# EAGLE board EMG_SS19_Version (EAGLE 9.4.1)
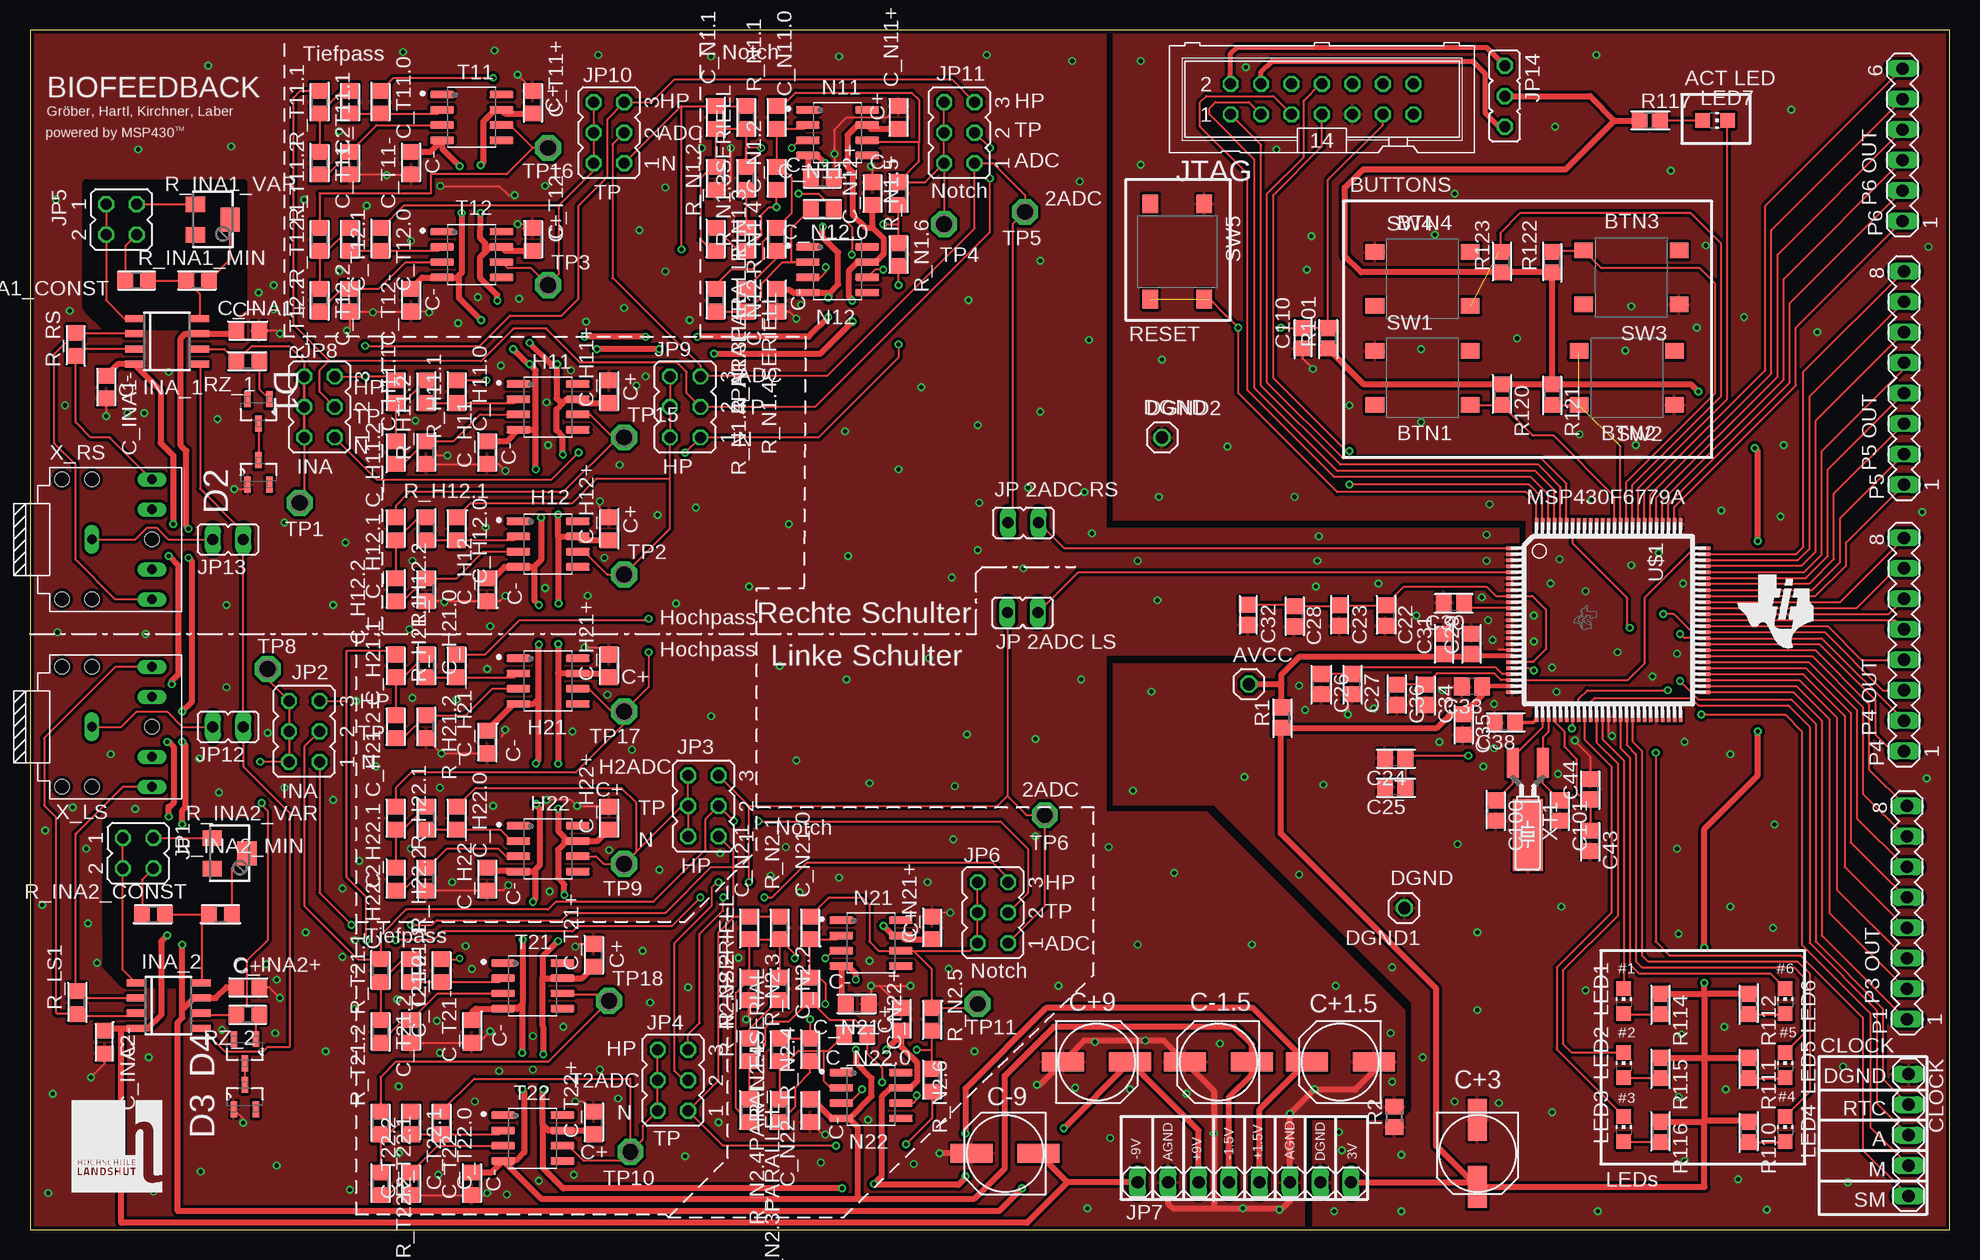
[diagram p2: board, top side]
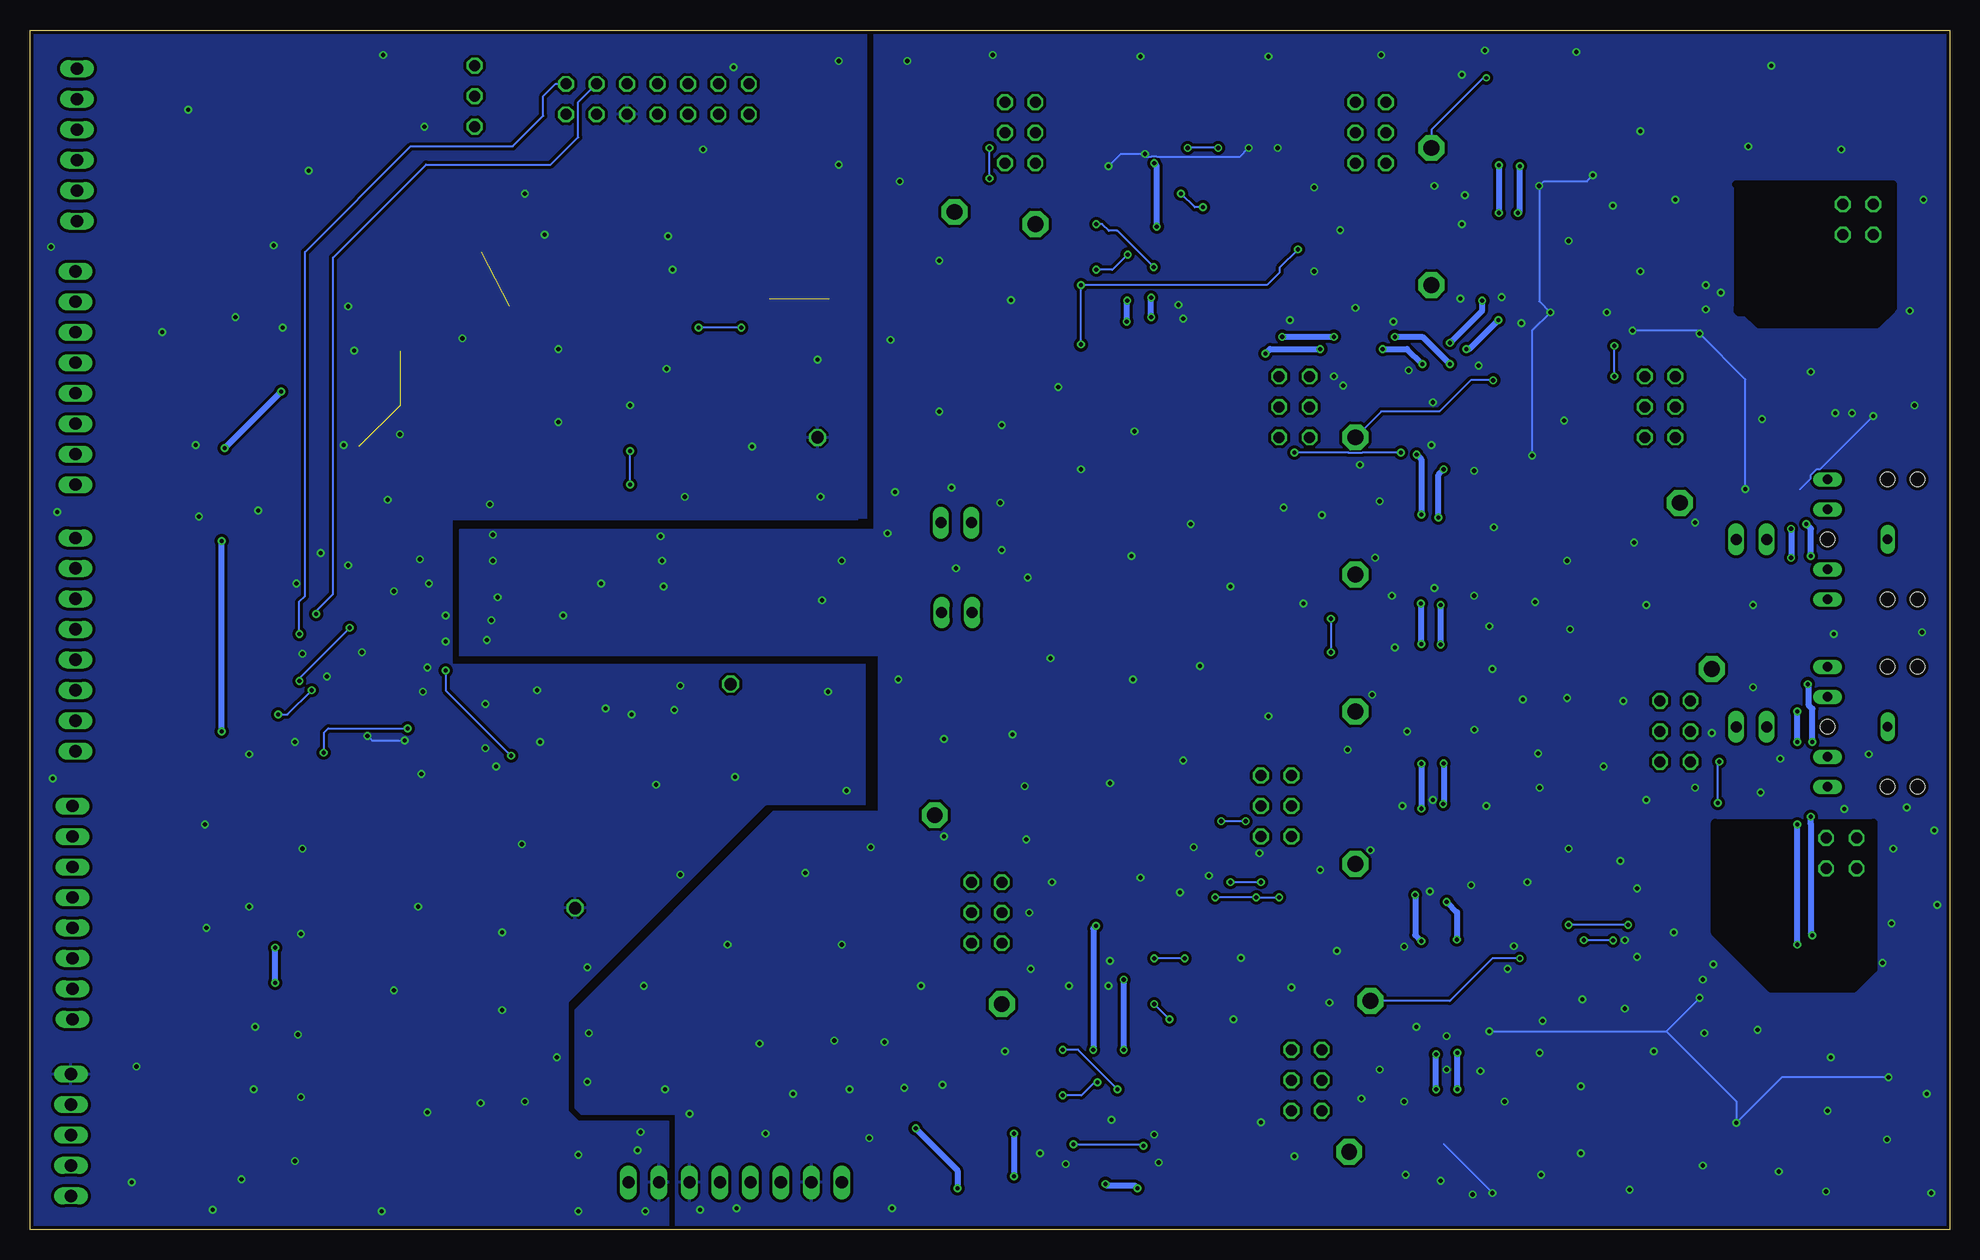
[diagram p3: board, bottom side, seen from below]

Size 160 x 100 mm. Coordinates in mm from the lower left corner, seen from the top.
Outline: 0,0 160,0 160,100 0,100 0,0
Copper layers (1*16): Top 0.035mm / dielectric 1.5mm / Bottom 0.035mm
Design rules "PCB-POOL Standard": minimum track width 0.15mm, minimum drill 0.3mm, track to track 0.15mm, track to pad 0.15mm, pad to pad 0.15mm, via to via 0.15mm, smd to smd 0.15mm, copper to edge 0.3mm, drill to drill 0.2mm, minimum pad ring 0.2mm, minimum via ring 0.15mm, stop-mask expansion 0.03mm, vias tented up to drill 0mil, thermal gap 0.2mm
tRestrict: area 4.7,76.8 to 17.8,87.2; area 6.3,24.9 to 19.7,34; area 4.8,75.3 to 17.7,76.8; area 6.3,20.4 to 19.7,24.9
bRestrict: area 4.7,76.8 to 17.8,87.1; area 6.3,24.9 to 19.6,33.9; area 6.3,20.1 to 19.6,24.9; area 4.8,75.4 to 17.7,76.8

## Footprints (pad centres in the part's own frame; a part is rotated, then mirrored left to right if it is on the bottom)
1X01 = drill 1.016 octagon: 1 0,0
C0805 = smd 1.3 x 1.5: 1 -0.85,0; 2 0.85,0
RADIAL_SMD_ELKO_6_3 = smd 3.5 x 1.6: + 2.8,0; - -2.8,0
C0805' = smd 1.3 x 1.5: 1 -0.95,0; 2 0.95,0
MA05-1 = drill 1.016 long: 1 -5.08,0; 2 -2.54,0; 3 0,0; 4 2.54,0; 5 5.08,0
SOT-23 = smd 1.321 x 0.559: 1 -1.016,0.914; 2 -1.016,-0.914; 3 1.016,0
SOIC127P600X175-8N = smd 1.97 x 0.6: 1 -2.475,1.905; 2 -2.475,0.635; 3 -2.475,-0.635; 4 -2.475,-1.905; 5 2.475,-1.905; 6 2.475,-0.635; 7 2.475,0.635; 8 2.475,1.905
SOIC8 = smd 0.6 x 1.5: 1 -1.905,-2.75; 2 -0.635,-2.75; 3 0.635,-2.75; 4 1.905,-2.75; 5 1.905,2.75; 6 0.635,2.75; 7 -0.635,2.75; 8 -1.905,2.75
JP2Q = drill 0.914 octagon: 1 -1.27,-1.27; 2 -1.27,1.27; 3 1.27,-1.27; 4 1.27,1.27
JP3Q = drill 0.914 octagon: 1 -2.54,-1.27; 2 -2.54,1.27; 3 0,-1.27; 4 0,1.27; 5 2.54,-1.27; 6 2.54,1.27
1X08 = drill 1.016 long: 1 -8.89,0; 2 -6.35,0; 3 -3.81,0; 4 -1.27,0; 5 1.27,0; 6 3.81,0; 7 6.35,0; 8 8.89,0
JP1 = drill 0.914 long: 1 0,-1.27; 2 0,1.27
JP2 = drill 0.914 octagon: 1 -2.54,0; 2 0,0; 3 2.54,0
ML14 = drill 0.914 octagon: 1 -7.62,-1.27; 2 -7.62,1.27; 3 -5.08,-1.27; 4 -5.08,1.27; 5 -2.54,-1.27; 6 -2.54,1.27; 7 0,-1.27; 8 0,1.27; 9 2.54,-1.27; 10 2.54,1.27; 11 5.08,-1.27; 12 5.08,1.27; 13 7.62,-1.27; 14 7.62,1.27
CHIP-LED0805 = smd 1.2 x 1.2: A 0,-1.05; C 0,1.05
MA08-1 = drill 1.016 long: 1 -8.89,0; 2 -6.35,0; 3 -3.81,0; 4 -1.27,0; 5 1.27,0; 6 3.81,0; 7 6.35,0; 8 8.89,0
MA06-1 = drill 1.016 long: 1 -6.35,0; 2 -3.81,0; 3 -1.27,0; 4 1.27,0; 5 3.81,0; 6 6.35,0
R0805 = smd 1.3 x 1.5: 1 -0.85,0; 2 0.85,0
R0805' = smd 1.3 x 1.5: 1 -0.95,0; 2 0.95,0
SM-42/43W = smd 1.3 x 1.6: 1 -1.27,-1.45; 3 1.27,-1.45 | smd 2 x 1.6: 2 0,1.45
SW_B3S-1000 = smd 1.55 x 1.3: 1 3.975,-2.25; 2 -3.975,-2.25; 3 3.975,2.25; 4 -3.975,2.25
P1-13 = drill 1.321 pad 2.159 octagon: TP 0,0
S-PQFP-G100(PZ) = smd 0.29 x 1: 1 -6,-8; 2 -5.5,-8; 3 -5,-8; 4 -4.5,-8; 5 -4,-8; 6 -3.5,-8; 7 -3,-8; 8 -2.5,-8; 9 -2,-8; 10 -1.5,-8; 11 -1,-8; 12 -0.5,-8; 13 0,-8; 14 0.5,-8; 15 1,-8; 16 1.5,-8; 17 2,-8; 18 2.5,-8; 19 3,-8; 20 3.5,-8; 21 4,-8; 22 4.5,-8; 23 5,-8; 24 5.5,-8; 25 6,-8; 51 6,8; 52 5.5,8; 53 5,8; 54 4.5,8; 55 4,8; 56 3.5,8; 57 3,8; 58 2.5,8; 59 2,8; 60 1.5,8; 61 1,8; 62 0.5,8; 63 0,8; 64 -0.5,8; 65 -1,8; 66 -1.5,8; 67 -2,8; 68 -2.5,8; 69 -3,8; 70 -3.5,8; 71 -4,8; 72 -4.5,8; 73 -5,8; 74 -5.5,8; 75 -6,8 | smd 1 x 0.29: 26 8,-6; 27 8,-5.5; 28 8,-5; 29 8,-4.5; 30 8,-4; 31 8,-3.5; 32 8,-3; 33 8,-2.5; 34 8,-2; 35 8,-1.5; 36 8,-1; 37 8,-0.5; 38 8,0; 39 8,0.5; 40 8,1; 41 8,1.5; 42 8,2; 43 8,2.5; 44 8,3; 45 8,3.5; 46 8,4; 47 8,4.5; 48 8,5; 49 8,5.5; 50 8,6; 76 -8,6; 77 -8,5.5; 78 -8,5; 79 -8,4.5; 80 -8,4; 81 -8,3.5; 82 -8,3; 83 -8,2.5; 84 -8,2; 85 -8,1.5; 86 -8,1; 87 -8,0.5; 88 -8,0; 89 -8,-0.5; 90 -8,-1; 91 -8,-1.5; 92 -8,-2; 93 -8,-2.5; 94 -8,-3; 95 -8,-3.5; 96 -8,-4; 97 -8,-4.5; 98 -8,-5; 99 -8,-5.5; 100 -8,-6
FC68131-5P = drill 0.8 long: 1 -5,0; 2 0,-5; 3 0,-2.5; 4 0,2.5; 5 0,5 | hole 1.2: 0,0; -5,-5; -5,5; -7.5,5; -7.5,-5
CM200T = smd 1 x 2.5: P1 -1.25,-5; P2 1.25,-5 | smd 2.5 x 6: P3 0,1

## Placement (x,y rotation side)
AVCC  [1X01]  101.6,45.47 0 top
C22  4.7uF  [C0805]  112.97,51.18 270 top
C23  100nF  [C0805]  109.16,51.18 270 top
C24  4.7uF  [C0805]  113.79,39.31 180 top
C25  100nF  [C0805]  113.79,36.89 180 top
C26  4.7uF  [C0805]  107.63,45.47 270 top
C27  100nF  [C0805]  110.17,45.47 270 top
C28  100nF  [C0805]  105.35,51.12 270 top
C29  4.7uF  [C0805]  120.14,48.83 90 top
C30  100nF  [C0805]  118.68,52.26 180 top
C31  100nF  [C0805]  117.86,48.83 90 top
C32  4.7uF  [C0805]  101.54,51.24 270 top
C33  100nF  [C0805]  120.21,45.28 180 top
C34  4.7uF  [C0805]  116.33,44.58 270 top
C35  4.7uF  [C0805]  119.44,42.1 270 top
C36  100nF  [C0805]  113.92,44.58 270 top
C38  0.47uF  [C0805]  122.94,42.29 180 top
C43  100nF  [C0805]  130.05,32.38 270 top
C44  0.47uF  [C0805]  130.05,36.7 90 top
C100  12pF  [C0805]  122.17,34.92 270 top
C101  12pF  [C0805]  127.51,34.92 270 top
C110  0.1uF  [C0805]  106.05,74.3 90 top
C+1.5  100u  [RADIAL_SMD_ELKO_6_3]  109.22,13.97 180 top
C+3  100u  [RADIAL_SMD_ELKO_6_3]  120.65,6.35 270 top
C+9  100u  [RADIAL_SMD_ELKO_6_3]  88.9,13.97 0 top
C-1.5  100u  [RADIAL_SMD_ELKO_6_3]  99.06,13.97 180 top
C-9  100u  [RADIAL_SMD_ELKO_6_3]  81.28,6.35 180 top
C_H11+  100n  [C0805']  48.26,69.85 90 top
C_H11-  100n  [C0805']  38.1,64.77 90 top
C_H11.0  10p  [C0805']  35.56,69.85 270 top
C_H11.1  470n  [C0805']  30.48,69.85 270 top
C_H11.2  470n  [C0805']  30.48,64.77 270 top
C_H12+  100n  [C0805']  48.26,58.42 90 top
C_H12-  100n  [C0805']  38.1,53.34 90 top
C_H12.0  10p  [C0805']  35.56,58.42 270 top
C_H12.1  470n  [C0805']  30.48,58.42 270 top
C_H12.2  470n  [C0805']  30.48,53.34 270 top
C_H21+  100n  [C0805']  48.26,46.99 90 top
C_H21-  100n  [C0805']  38.1,40.64 90 top
C_H21.0  10p  [C0805']  35.56,46.99 270 top
C_H21.1  470n  [C0805']  30.48,46.99 270 top
C_H21.2  470n  [C0805']  30.48,41.91 270 top
C_H22+  100n  [C0805']  48.26,34.29 90 top
C_H22-  100n  [C0805']  38.1,29.21 90 top
C_H22.0  10p  [C0805']  35.56,34.29 270 top
C_H22.1  470n  [C0805']  30.48,34.29 270 top
C_H22.2  470n  [C0805']  30.48,29.21 270 top
C_INA1+  100n  [C0805']  18.16,74.93 0 top
C_INA1-  100n  [C0805']  6.35,70.23 270 top
C_INA2+  100n  [C0805']  18.16,20.19 0 top
C_INA2-  100n  [C0805']  6.22,15.62 270 top
C_N1.1  470n  [C0805']  57.15,92.71 270 top
C_N1.2  4.7n  [C0805']  62.23,87.63 90 top
C_N2.1  470n  [C0805']  59.94,25.15 270 top
C_N2.2  4.7n  [C0805']  65.02,20.07 90 top
C_N11+  100n  [C0805']  72.39,92.71 90 top
C_N11-  100n  [C0805']  66.04,87.63 180 top
C_N11.0  10p  [C0805']  62.23,92.71 270 top
C_N12+  100n  [C0805']  70.23,86.36 90 top
C_N12-  100n  [C0805']  62.23,77.47 90 top
C_N12.0  10p  [C0805']  66.04,85.09 0 top
C_N21+  100n  [C0805']  75.18,25.15 90 top
C_N21-  100n  [C0805']  68.96,18.8 180 top
C_N21.0  10p  [C0805']  65.02,25.15 270 top
C_N22+  100n  [C0805']  72.64,17.53 90 top
C_N22-  100n  [C0805']  65.02,9.91 90 top
C_N22.0  10p  [C0805']  68.83,16.26 0 top
C_T11+  100n  [C0805']  41.91,93.98 90 top
C_T11-  100n  [C0805']  31.75,88.9 90 top
C_T11.0  10p  [C0805']  29.21,93.98 270 top
C_T11.1  10n  [C0805']  26.67,93.98 270 top
C_T11.2  4.7n  [C0805']  26.67,88.9 90 top
C_T12+  100n  [C0805']  41.91,82.55 90 top
C_T12-  100n  [C0805']  31.75,77.47 90 top
C_T12.0  10p  [C0805']  29.21,82.55 270 top
C_T12.1  10n  [C0805']  26.67,82.55 270 top
C_T12.2  4.7n  [C0805']  26.67,77.47 90 top
C_T21+  100n  [C0805']  46.99,22.86 90 top
C_T21-  100n  [C0805']  36.83,16.51 90 top
C_T21.0  10p  [C0805']  34.29,21.59 270 top
C_T21.1  10n  [C0805']  31.75,21.59 270 top
C_T21.2  4.7n  [C0805']  31.75,16.51 90 top
C_T22+  100n  [C0805']  46.99,8.89 90 top
C_T22-  100n  [C0805']  36.83,3.81 90 top
C_T22.0  10p  [C0805']  34.29,8.89 270 top
C_T22.1  10n  [C0805']  31.75,8.89 270 top
C_T22.2  4.7n  [C0805']  31.75,3.81 90 top
CLOCK  [MA05-1]  156.59,7.87 270 top
D1  Zener  [SOT-23]  19.05,68.2 270 top
D2  Zener  [SOT-23]  19.05,63.12 90 top
D3  Zener  [SOT-23]  17.91,11.05 90 top
D4  Zener  [SOT-23]  17.91,14.86 270 top
DGND1  [1X01]  114.55,26.8 180 top
DGND2  [1X01]  94.36,66.04 0 top
H11  OPA388  [SOIC127P600X175-8N]  43.18,68.58 0 top
H12  OPA388  [SOIC127P600X175-8N]  43.18,57.15 0 top
H21  OPA388  [SOIC127P600X175-8N]  43.18,45.72 0 top
H22  OPA388  [SOIC127P600X175-8N]  43.18,31.75 0 top
INA_1  INA828ID  [SOIC8]  11.43,74.04 270 top
INA_2  INA828ID  [SOIC8]  11.56,18.67 270 top
JP1  [JP2Q]  9.02,31.37 270 top
JP2  [JP3Q]  22.86,41.53 90 top
JP3  [JP3Q]  56.13,35.31 90 top
JP4  [JP3Q]  53.59,12.45 90 top
JP5  [JP2Q]  7.62,84.2 270 top
JP6  [JP3Q]  80.26,26.42 90 top
JP7  [1X08]  101.22,3.94 0 top
JP8  [JP3Q]  24.13,68.58 90 top
JP9  [JP3Q]  54.61,68.58 90 top
JP10  [JP3Q]  48.26,91.44 90 top
JP11  [JP3Q]  77.47,91.44 90 top
JP12  [JP1]  16.51,41.91 90 top
JP13  [JP1]  16.51,57.53 90 top
JP14  [JP2]  122.94,94.49 270 top
JP15  [JP1]  82.8,58.93 90 top
JP16  [JP1]  82.74,51.44 90 top
JTAG  [ML14]  107.7,94.23 0 top
LED1  [CHIP-LED0805]  132.84,19.05 0 top
LED2  [CHIP-LED0805]  132.84,13.72 0 top
LED3  [CHIP-LED0805]  132.84,8.38 0 top
LED4  [CHIP-LED0805]  146.3,8.38 0 top
LED5  [CHIP-LED0805]  146.3,13.72 0 top
LED6  [CHIP-LED0805]  146.3,19.05 0 top
LED7  [CHIP-LED0805]  140.46,92.46 270 top
N11  OPA388  [SOIC127P600X175-8N]  67.31,91.44 0 top
N12  OPA388  [SOIC127P600X175-8N]  67.31,80.01 0 top
N21  OPA388  [SOIC127P600X175-8N]  70.1,23.88 0 top
N22  OPA388  [SOIC127P600X175-8N]  70.1,11.18 0 top
P1  [MA08-1]  156.46,26.42 90 top
P4  [MA08-1]  156.21,48.77 90 top
P5  [MA08-1]  156.21,70.99 90 top
P6  [MA06-1]  156.08,90.42 90 top
R1  10R  [R0805]  104.33,42.67 90 top
R2  0R  [R0805]  113.73,9.4 90 top
R101  47K  [R0805]  108.2,74.3 90 top
R110  100  [R0805]  143.26,8.13 270 top
R111  100  [R0805]  143.26,13.46 270 top
R112  100  [R0805]  143.26,18.8 270 top
R114  100  [R0805]  135.89,18.8 270 top
R115  100  [R0805]  135.89,13.46 270 top
R116  100  [R0805]  135.89,8.13 270 top
R117  100  [R0805]  135,92.46 0 top
R120  100K  [R0805]  122.68,69.6 270 top
R121  100K  [R0805]  126.87,69.6 270 top
R122  100K  [R0805]  126.87,80.64 90 top
R123  100K  [R0805]  122.68,80.64 90 top
R_H11.1  48k  [R0805']  33.02,69.85 270 top
R_H11.2  100k  [R0805']  33.02,64.77 90 top
R_H12.1  48k  [R0805']  33.02,58.42 270 top
R_H12.2  100k  [R0805']  33.02,53.34 90 top
R_H21.1  48k  [R0805']  33.02,46.99 270 top
R_H21.2  100k  [R0805']  33.02,41.91 90 top
R_H22.1  48k  [R0805']  33.02,34.29 270 top
R_H22.2  100k  [R0805']  33.02,29.21 90 top
R_INA1_CONST  200  [R0805']  8.89,79.12 0 top
R_INA1_MIN  50  [R0805']  13.97,79.12 180 top
R_INA1_VAR  200  [SM-42/43W]  15.24,84.2 270 top
R_INA2_CONST  200  [R0805']  10.29,26.29 0 top
R_INA2_MIN  50  [R0805']  15.88,26.29 180 top
R_INA2_VAR  200  [SM-42/43W]  16.64,31.37 270 top
R_LS1  10Meg  [R0805']  3.94,18.92 90 top
R_N1.1  138k  [R0805']  59.69,92.71 270 top
R_N1.2  138k  [R0805']  57.15,87.63 90 top
R_N1.3  6.8k  [R0805']  59.69,87.63 90 top
R_N1.3PARALLEL  dnp  [R0805']  57.15,82.55 270 top
R_N1.3SERIELL  0  [R0805']  59.69,82.55 90 top
R_N1.4  6.8k  [R0805']  62.23,82.55 270 top
R_N1.4PARALLEL  dnp  [R0805']  57.15,77.47 270 top
R_N1.4SERIELL  0  [R0805']  59.69,77.47 270 top
R_N1.5  100k  [R0805']  72.39,86.36 90 top
R_N1.6  100k  [R0805']  72.39,81.28 90 top
R_N2.1  138k  [R0805']  62.48,25.15 270 top
R_N2.2  138k  [R0805']  59.94,20.07 90 top
R_N2.3  6.8k  [R0805']  62.48,20.07 90 top
R_N2.3PARALLEL  dnp  [R0805']  59.94,9.91 270 top
R_N2.3SERIELL  0  [R0805']  59.94,14.99 90 top
R_N2.4  6.8k  [R0805']  65.02,14.99 270 top
R_N2.4PARALLEL  dnp  [R0805']  62.48,14.99 270 top
R_N2.4SERIAL  0  [R0805']  62.48,9.91 90 top
R_N2.5  100k  [R0805']  75.18,17.53 90 top
R_N2.6  100k  [R0805']  75.18,12.45 90 top
R_RS  10Meg  [R0805']  3.81,73.79 90 top
R_T11.1  47k  [R0805']  24.13,93.98 270 top
R_T11.2  47k  [R0805']  24.13,88.9 270 top
R_T12.1  47k  [R0805']  24.13,82.55 270 top
R_T12.2  47k  [R0805']  24.13,77.47 270 top
R_T21.1  47k  [R0805']  29.21,21.59 270 top
R_T21.2  47k  [R0805']  29.21,16.51 270 top
R_T22.1  47k  [R0805']  29.21,8.89 270 top
R_T22.2  47k  [R0805']  29.21,3.81 270 top
RZ_1  2k  [R0805']  18.16,72.39 180 top
RZ_2  2k  [R0805']  18.16,17.91 180 top
SW1  B3S-1000  [SW_B3S-1000]  116.08,70.99 0 top
SW2  B3S-1000  [SW_B3S-1000]  133.1,70.99 180 top
SW3  B3S-1000  [SW_B3S-1000]  133.48,79.38 180 top
SW4  B3S-1000  [SW_B3S-1000]  116.08,79.25 0 top
SW5  B3S-1000  [SW_B3S-1000]  95.63,81.53 270 top
T11  OPA388  [SOIC127P600X175-8N]  36.83,92.71 0 top
T12  OPA388  [SOIC127P600X175-8N]  36.83,81.28 0 top
T21  OPA388  [SOIC127P600X175-8N]  41.91,20.32 0 top
T22  OPA388  [SOIC127P600X175-8N]  41.91,7.62 0 top
TP1  TPPAD1-13  [P1-13]  22.48,60.58 0 top
TP2  TPPAD1-13  [P1-13]  49.53,54.61 0 top
TP3  TPPAD1-13  [P1-13]  43.18,78.74 0 top
TP4  TPPAD1-13  [P1-13]  76.2,83.82 0 top
TP5  RS_TO_ADC  [P1-13]  82.93,84.84 0 top
TP6  LS_TO_ADC  [P1-13]  84.58,34.54 0 top
TP8  TPPAD1-13  [P1-13]  19.81,46.74 0 top
TP9  TPPAD1-13  [P1-13]  49.53,30.48 0 top
TP10  TPPAD1-13  [P1-13]  50.04,6.48 0 top
TP11  TPPAD1-13  [P1-13]  78.99,18.8 0 top
TP15  TPPAD1-13  [P1-13]  49.53,66.04 0 top
TP16  TPPAD1-13  [P1-13]  43.18,90.17 0 top
TP17  TPPAD1-13  [P1-13]  49.53,43.18 0 top
TP18  TPPAD1-13  [P1-13]  48.26,19.05 0 top
U$1  MSP430F6779PZ  [S-PQFP-G100(PZ)]  131.57,50.8 270 top
X_LS  KLINKENBUCHSE  [FC68131-5P]  10.16,41.91 0 top
X_RS  KLINKENBUCHSE  [FC68131-5P]  10.16,57.53 0 top
XT1  [CM200T]  124.84,33.91 180 top

## Tracks (layer width: path | path; a pad name or v marks a point on that pad's centre or on a via)
+1.5V  (via drill 0.35)
  Top 0.508: JP7.5 102.49,10.04 C+1.5.+ 101.93,18.46 84.7,18.46 77.98,11.74 v77.98,8 | 72.64,16.26 72.64,15.21 73.97,13.88 73.97,12.4 73.38,11.81 N22.7 71.75,11.81 70.99,11.05 70.99,4.43 v70.36,3.8 70.43,3.73 77.39,3.73 77.98,4.32 v77.98,4.45 | 72.64,16.26 C_N22+.1 | C_N21+.1 72.89,24.2 N21.7 71.94,24.51 v71.14,25.31 | v71.37,14.99 72.64,16.26 | C_N11+.1 70.1,91.76 N11.7 69.28,92.08 69.22,92.02 68.93,92.02 68.14,91.23 68.14,88.58 68.58,88.14 68.58,84.58 69.63,83.53 70.23,83.53 | C_T11+.1 39.62,93.03 T11.7 38.8,93.34 38.74,93.29 38.7,93.29 37.79,92.37 37.79,88.97 v37.56,88.74 | C_T12+.1 39.62,81.6 T12.7 38.81,81.92 38.74,81.98 38.45,81.98 37.94,81.48 | C_H11+.1 45.97,68.9 H11.7 44.73,69.22 44.36,68.84 | C_H22+.1 47.3,32.38 H22.7 44.55,32.38 | C_T21+.1 46.03,20.95 T21.7 44.32,20.89 42.9,20.89 42.74,21.04 | C_T22+.1 46.67,8.26 T22.7 43.21,8.26 42.74,8.72 | v44.03,48.8 44.01,48.78 44.01,46.35 | 44.01,46.35 44.01,38.85 v44.03,38.83 | v44.03,35.09 44.03,33.21 44.55,32.7 44.55,32.38 | 44.55,32.38 44.55,32.2 44.01,31.66 44.01,29.3 44.54,28.77 v44.54,27.9 | v44.03,24.04 44.03,24.07 42.74,22.77 42.74,21.04 | 42.74,21.04 42.74,16.95 42.8,16.89 v42.8,14.61 | 44.01,57.78 44.01,59.6 v44.03,59.6 | 44.36,68.84 43.88,68.37 43.88,66.63 44.41,66.1 v44.41,64.61 | 44.36,68.84 43.88,69.31 43.88,70.91 43.94,70.97 v43.94,72.14 43.43,72.14 v41.66,73.91 | v68.54,77.43 68.54,77.53 68.27,77.81 68.27,79.92 68.93,80.59 69.73,80.59 N12.7 69.85,80.58 70.39,80.58 71.17,81.36 71.17,82.59 70.23,83.53 | v38.95,77.43 38.95,77.92 37.53,79.33 37.53,81.07 37.94,81.48 | 37.94,81.48 37.94,82.23 37.53,82.64 37.53,83.35 37.54,83.36 37.54,83.59 37.56,83.6 v37.56,84.75
  Top 0.508: v67.69,3.43 44.45,3.43 42.74,5.14 42.74,8.72 | C_H21+.1 47.95,46.35 H21.7 44.01,46.35 | 44.01,57.78 H12.7 45.97,57.47 C_H12+.1 | v42.8,11.68 42.74,11.63 42.74,8.72 | v44.07,52.2 44.01,52.25 44.01,57.78 | 70.23,83.53 C_N12+.1 | v52.45,73.41 v47.24,73.41 | v57.02,73.03 65.91,73.03 v68.58,75.69
  Bottom 0.508: v71.14,25.31 71.37,25.07 v71.37,14.99 | v44.03,38.83 v44.03,35.09 | v44.54,27.9 44.54,24.55 v44.03,24.04 | v44.03,59.6 44.03,64.23 v44.41,64.61 | v38.95,77.43 38.95,76.62 v41.66,73.91 | v37.56,88.74 v37.56,84.75 | v77.98,8 v77.98,4.45 | v70.36,3.8 70.23,3.67 67.94,3.67 v67.69,3.43 | v42.8,11.68 v42.8,14.61 | v44.07,52.2 44.07,48.84 v44.03,48.8 | v43.94,72.14 45.21,73.41 v47.24,73.41 | v57.02,73.03 56.64,73.41 v52.45,73.41 | v68.58,75.69 68.54,75.73 v68.54,77.43
+9V  (via drill 0.35)
  Top 0.508: C_INA1+.1 16.96,74.68 INA_1.7 12.95,74.68 12.57,74.3 12.57,65.35 13.03,64.9 13.03,58.6 v13.21,58.42 | JP7.3 97.41,8.26 C+9.+ v86.17,8.44 | C_INA2+.1 16.38,20.19 15.49,19.3 INA_2.7 13.7,19.3 12.7,18.3 | v82.69,3.43 80.78,1.52 12.32,1.52 12.32,17.29 12.7,17.67 12.7,18.3 | 12.7,18.3 v12.7,23.75 | v12.7,43.18 13.46,43.94 13.46,55.75 v13.21,56.01 | v12.7,33.78 12.7,34.92 12.95,35.18 12.95,40.39 v12.7,40.64
  Bottom 0.508: v12.7,23.75 v12.7,33.78 | v12.7,40.64 v12.7,43.18 | v86.17,8.44 82.69,4.96 v82.69,3.43 | v13.21,58.42 v13.21,56.01
-1.5V  (via drill 0.35)
  Top 0.508: JP7.4 99.95,11.04 101.86,12.95 C-1.5.- 101.86,15.43 100.37,16.91 85.35,16.91 81.27,12.83 81.27,5.1 78.73,2.56 68.96,2.56 | C_N21-.2 67.63,19.18 N21.4 68.2,21.97 68.83,21.34 v68.83,20.83 | N22.4 66.81,9.27 65.22,10.86 C_N22-.2 | v68.83,14.99 68.83,13.94 70.16,12.62 70.16,11.13 68.3,9.27 N22.4 | v42.42,48.77 42.35,48.7 42.35,44.2 | v42.2,35.47 42.2,35.36 42.48,35.09 42.48,30.35 42.09,29.97 | v41.06,24.17 41.08,24.15 41.08,18.81 41.02,18.76 | 41.02,18.76 v41.02,14.73 | T22.4 39.49,5.77 40.54,5.77 41.2,6.43 41.2,11.5 v41.02,11.68 | v35.98,84.75 36,84.75 36,79.76 35.74,79.5 | v66.08,83.6 66.08,82.74 67.37,81.45 67.37,78.8 66.67,78.11 | C_N11-.2 64.83,87.89 N11.4 65.66,89.53 v66.29,88.9 | C_T11-.2 33.4,89.85 T11.4 34.35,90.11 v35.81,88.65 | C_H11-.2 39.75,65.72 H11.4 42.04,66.67 42.16,66.8 | C_H12-.2 38.61,54.29 39.56,55.24 H12.4 42.04,55.24 | C_H21-.2 40.33,43.81 H21.4 41.97,43.81 42.35,44.2 | C_H22-.2 38.35,29.91 40.64,29.91 H22.4 41.97,29.84 42.09,29.97 | C_T21-.2 36.83,18.1 37.15,18.41 T21.4 39.49,18.47 40.64,18.47 40.64,18.38 41.02,18.76 | C_T22-.2 38.48,4.76 T22.4 | C_T12-.2 32.7,79.38 T12.4 35.62,79.38 35.74,79.5 | C_N12-.2 62.36,78.29 63.38,78.29 63.56,78.11 N12.4 66.67,78.11 | v37.59,75.82 35.74,77.67 35.74,79.5 | v66.55,77.69 66.67,77.81 66.67,78.11 | v41.91,27.3 42.09,27.49 42.09,29.97 | N22.4 68.26,9.27 68.96,8.57 68.96,2.56 | T22.4 42.59,2.56 68.96,2.56 | v42.16,63.37 42.16,66.8 | 42.35,44.2 42.35,39.05 v42.16,38.86 | v42.6,59.35 42.6,55.81 42.04,55.24 | 42.04,55.24 42.04,52.45 v42.42,52.07 | v51.31,74.42 v46.23,74.42 | v55.63,74.42 64.9,74.42 v66.55,76.07 | 42.16,66.8 42.16,71.63 v41.66,72.14 41.53,72.14 v40.26,73.41
  Bottom 0.508: v41.06,24.17 41.06,26.45 v41.91,27.3 | v35.98,84.75 35.85,84.87 35.85,88.61 v35.81,88.65 | v66.08,83.6 66.08,88.68 v66.29,88.9 | v68.83,20.83 v68.83,14.99 | v41.02,11.68 v41.02,14.73 | v42.16,38.86 42.16,35.51 v42.2,35.47 | v42.42,52.07 v42.42,48.77 | v42.6,59.35 42.6,62.94 v42.16,63.37 | v46.23,74.42 43.94,74.42 v41.66,72.14 | v55.63,74.42 v51.31,74.42 | v66.55,76.07 v66.55,77.69 | v40.26,73.41 40.01,73.41 v37.59,75.82
-9V  (via drill 0.35)
  Top 0.508: C_INA1-.1 7.3,72.14 INA_1.4 10.88,69.94 10.88,65.58 11.94,64.52 v11.94,58.8 | JP7.1 86.49,3.94 | 86.49,3.94 C-9.- | 86.49,3.94 83.11,0.55 7.62,0.55 7.62,16.76 | v11.43,24.51 10.92,24 10.92,17.86 9.82,16.76 INA_2.4 7.62,16.76 | v11.56,34.42 11.56,35.25 11.68,35.27 12.02,35.6 12.02,40.21 11.59,40.64 v11.43,40.64 | v11.56,56.13 11.58,56.13 12.4,55.32 12.4,46.31 11.81,45.72 v11.81,45.47 | C_INA2-.1 6.42,16.76 7.62,16.76
  Bottom 0.508: v11.43,24.51 11.56,24.64 11.55,33.78 v11.56,34.42 | v11.43,40.64 11.43,43.41 11.76,43.74 11.76,45.42 v11.81,45.47 | v11.56,56.13 11.56,58.42 v11.94,58.8
ACLK
  Top 0.152: U$1.35 130.07,43.97 130.43,44.32 138.43,44.32 139.06,43.69 146.56,43.69 148.34,41.91 148.34,23.88 153.92,18.29 153.92,10.54 CLOCK.3
ACT_LED
  Top 0.152: U$1.83 134.07,61.81 141.48,69.22 141.48,92.42 LED7.C
AGND  (via drill 0.35)
  Top 0.152: U$1.2 123.53,56.26 | 31.68,87.88 C_T11-.1 29.78,87.95 v29.72,87.88 29.65,87.95 C_T11.2.1 | v34.21,87 39.12,87 39.88,86.23 v40.39,86.23 | v40.64,83.82 41.59,83.82 C_T12+.2 | v63.88,75.95 63.31,76.52 C_N12-.1 | C_H12+.2 47.5,60.13 v47.5,60.71 | v39.62,63.25 39.05,63.82 C_H11-.1 R_H11.2.1 33.72,64.52 v34.8,64.52 | R_H12.2.1 34.48,52.39 v34.54,52.32 34.61,52.39 C_H12-.1 39.18,52.39 v39.62,52.83 | v46.23,48.51 47.69,48.51 C_H21+.2 | 38.1,39.87 C_H21-.1 v34.29,39.69 R_H21.2.1 | v39.62,41.66 39.62,41.41 39.33,41.13 39.33,41.1 | C_H22+.2 48.19,35.31 v45.59,35.31 45.09,35.81 v43.05,35.81 | R_H22.2.1 C_H22-.1 39.44,28.26 v39.88,28.7 | v45.47,23.58 45.7,23.81 C_T21+.2 | C_T21.2.1 C_T21-.1 37.4,15.56 v38.35,16.51 | v20.83,19.3 19.94,20.19 C_INA2+.2 | v17.78,8.89 17.78,9.25 D3.1 | v45.47,10.67 46.16,10.67 C_T22+.2 | C_T22.2.1 C_T22-.1 37.91,2.86 v38.1,3.05 | v59.69,17.53 59.94,17.78 R_N2.2.1 | v66.29,7.92 66.06,7.92 C_N22-.1 | C_N21-.1 70.1,18.99 v70.1,20.32 70.8,20.32 | 70.8,20.32 C_N22+.2 | 70.8,20.32 v73.41,20.32 | v76.71,26.42 75.5,26.42 C_N21+.2 | C_INA1-.2 v6.35,67.82 | v17.02,61.72 17.75,61.72 D2.1 | v20.83,74.68 20.57,74.93 C_INA1+.2 | v26.42,74.93 26.67,75.18 C_T12.2.1 C_T12-.1 33.21,76.52 v33.27,76.45 | v40.64,96.27 41.91,95 C_T11+.2 | R_N1.2.1 57.66,86.68 58.42,87.44 v58.42,90.17 | C_N11-.1 67.06,87.7 v67.06,89.66 67.06,91.69 68.07,92.71 71.44,92.71 C_N11+.2 | v70.1,88.65 70.23,88.52 C_N12+.2 | 123.57,52.32 U$1.10 | U$1.7 U$1.6 | 122.43,48.39 122.52,48.3 U$1.18 | v5.08,12.7 6.22,13.84 C_INA2-.2
  Top 0.508: JP7.2 94.87,2.16 95.25,1.78 98.68,1.78 | 98.68,1.78 v101.09,1.78 104.39,1.78 105.03,2.41 JP7.6 v105.03,9.65 v107.06,11.68 110.49,11.68 112.02,13.21 C+1.5.- | 98.68,1.78 v98.68,8 98.68,11.55 C-1.5.+ 94.48,15.75 v92.96,15.75 87.88,15.75 C+9.- 84.19,12.06 v83.95,12.06 | C-9.+ v75.82,6.35
  Bottom 0.152: 38.61,16.51 v38.35,16.51 23.62,16.51 | 23.62,16.51 v20.83,19.3 | 23.62,16.51 17.78,10.67 v17.78,8.89 13.97,12.7 v5.08,12.7 | v38.1,3.05 42.16,7.11 | v6.35,67.82 10.81,63.36 11.1,63.36 11.59,62.87 11.59,62.58 12.45,61.72 | v17.02,61.72 17.02,70.87 v20.83,74.68 21.08,74.93 v26.42,74.93 | v29.72,87.88 30.23,87.38 33.83,87.38 v34.21,87 34.21,77.39 v33.27,76.45 34.8,74.93 v34.8,64.52 | v58.42,90.17 59.18,89.41 66.02,89.41 66.07,89.45 66.52,89.45 66.57,89.41 67.06,89.41 v67.06,89.66 69.09,89.66 v70.1,88.65
  other vias: 56.77,42.8 62.48,46.99 68.07,45.85 53.85,52.2 59.94,53.59 68.2,56.13 76.83,54.36 34.04,4.57 30.73,6.35 26.67,3.3 20.57,5.33 14.22,4.83 10.29,3.17 10.16,9.91 9.91,14.35 24.64,14.86 1.52,3.05 5.21,7.49 1.91,11.3 5.59,22.23 1.02,27.05 26.04,22.73 22.99,24.77 27.05,18.41 30.73,11.94 27.43,30.73 28.83,38.61 25.27,35.81 21.21,36.83 19.81,41.4 15.75,36.45 3.56,35.18 1.27,33.27 14.1,39.24 27.18,44.07 25.27,52.07 16.38,45.21 16.38,52.07 9.65,49.66 2.29,49.78 26.29,57.28 21.21,58.93 15.62,67.56 9.53,68.07 3.3,76.58 2.16,85.85 9.02,90.04 14.86,97.03 16.76,90.3 22.86,85.85 28.07,85.34 31.11,98.17 35.69,75.56 38.73,98.3 47.37,97.92 56.77,97.79 67.44,97.79 79.76,97.92 52.96,86.87 40.77,77.6 49.53,76.83 52.96,79.88 78.23,77.47 86.87,97.41 87.5,87.38 84.2,80.77 88.27,74.17 84.2,68.2 78.99,67.06 74.3,70.23 67.94,66.55 55.5,60.2 63.25,58.8 72.39,63.37 87.88,61.47 93.98,52.45 74.93,47.62 108.84,20.32 101.85,23.75 95.38,29.72 92.33,23.75 78.74,14.86 85.72,20.32 89.92,31.88 87.63,45.85 78.11,41.27 83.82,40.89 77.09,36.96 69.98,37.21 63.88,39.12 50.16,40.01 90.04,7.62 88.14,1.78 65.91,5.59 54.61,6.1 45.34,4.57 42.42,4.06 39.75,2.92 47.5,13.34 49.02,10.92 54.86,20.19 51.69,18.92 41.91,13.34 39.12,13.21 34.16,14.73 36.32,23.62 35.18,28.96 43.31,28.19 52.45,29.97 34.16,36.83 45.21,41.53 35.56,44.2 46.48,52.83 38.35,50.29 42.93,53.47 42.93,87 31.62,50.04 83.82,32.77 76.96,32.51 62.99,31.88 57.53,31.37 67.44,29.34 51.05,23.24 36.83,21.72 33.91,17.4 37.08,10.67 4.83,25.53 4.7,31.75 6.73,39.62 27.05,24.13 26.04,28.45 11.56,71.5 25.78,91.57 25.78,79.88 31.75,82.42 31.88,55.75 37.97,58.55 32.13,67.44 47.88,56.01 38.1,46.74 31.88,44.32 48.13,44.58 38.61,35.31 31.75,31.75 48.26,31.62 16,16.64 30.61,19.18 54.99,75.82 50.8,83.31 56.01,90.17 115.57,51.18 121.54,50.8 121.03,52.7 121.41,55.75 121.41,57.91 112.39,53.85 107.19,53.59 107.31,55.75 107.44,57.78 82.8,55.12 92.33,55.75 88.52,58.04 83.19,61.85 79.12,60.58 78.99,56.64 46.35,75.69 50.55,70.36 69.85,9.14 43.18,65.41 39.24,72.01 43.05,68.96 37.34,77.72 44.45,16.89 41.91,16.13 52.32,59.56 49.15,63.75 51.31,71.12 45.09,71.63 113.41,16.38 113.54,12.32 104.14,1.65 91.69,11.68 87.12,11.81 88.77,15.62 99.19,15.49 96.39,11.3 73.66,5.46 76.58,21.72 74.8,28.96 8.76,35.05 20.57,20.83 19.68,22.1 20.45,16.38 28.57,76.45 20.32,76.71 8.13,68.07 19.05,78.11 20.32,78.74 57.4,8.93 59.05,22.65 64.14,28.11 61.72,29.51 69.98,22.4 64.26,77.09 121.92,49.15 2.92,68.71
  pour Top (isolate 0.254): 0,100.08 89.66,100.08 89.66,58.42 124.08,58.42 124.08,47.88 89.66,47.88 89.66,34.8 98.04,34.8 114.55,18.29 114.55,10.16 114.05,9.65 106.17,9.65 106.17,0 0,0
  pour Bottom (isolate 0.254): 0,100.08 89.66,100.08 89.66,58.29 124.21,58.29 124.21,47.88 89.28,47.88 89.28,34.8 98.04,34.8 114.55,18.29 114.55,10.16 114.05,9.65 106.17,9.65 106.17,0 0,0
AUXVCC1
  Top 0.178: U$1.22 122.74,46.3 122.17,46.86 110.72,46.86 C27.1 C26.1
AUXVCC2  (via drill 0.35)
  Top 0.178: U$1.21 125.16,46.8 v125.35,46.61 | v119.89,39.5 114.83,39.5 C24.1 C25.1
  Bottom 0.178: v125.35,46.61 125.35,44.96 v119.89,39.5
AUXVCC3
  Top 0.15: U$1.29 127.07,42.34 127.33,42.08 127.34,42.08 127.89,41.53 127.89,40.26 128.91,39.24 128.91,36.45 129.5,35.85 C44.1
  Top 0.152: C44.1 C43.1
AVCC
  Top 0.178: C31.1 117.98,47.98 | 120.32,47.8 C29.1
  Top 0.356: C31.1 118.11,47.73 | 119.89,47.73 C29.1 | 117.73,47.73 117.98,47.98
  Top 0.406: U$1.19 120.32,47.8
  Top 0.508: 119.89,47.73 118.11,47.73 | R1.2 104.33,45.47 | 104.33,45.47 104.33,46.29 105.77,47.73 117.73,47.73 | AVCC.1 104.33,45.47
BTN1
  Top 0.152: U$1.87 132.07,61.09 127,66.17 125.26,66.17 122.77,68.66 R120.2 | R120.2 | SW1.1 R120.2
BTN2  (2 unrouted)
  Top 0.152: R121.2 129.12,68.75 | U$1.86 132.57,65.29
BTN3
  Top 0.152: U$1.85 133.07,62.33 140.46,69.72 140.46,78.87 139.19,80.14 130.99,80.14 SW3.1 | SW3.1 | R122.2 127,81.62 SW3.1
BTN4  (1 unrouted)
  Top 0.152: 122.46,81.5 122.56,81.5 | 122.56,81.5 R123.2 | U$1.84 133.57,62.07 140.97,69.47 140.97,82.17 138.43,84.71 124.21,84.71 122.56,83.06 122.56,81.66 | 122.56,81.66 122.56,81.5 | 122.39,81.5 122.56,81.66
DGND  (via drill 0.35)
  Top 0.152: C110.1 106.05,72.64 v106.93,71.75 | C27.2 109.86,44.3 v109.86,42.93 | U$1.38 131.57,41.45 v131.88,41.15 | v128.78,40.77 128.78,40.73 130.05,39.46 C44.2
  Bottom 0.152: v131.88,41.15 131.5,40.77 v128.78,40.77
  other vias: 92.58,97.41 106.81,82.8 92.58,88.77 94.36,72.52 118.75,86.36 99.82,65.28 94.11,61.09 105.41,61.09 109.98,68.71 121.67,60.45 130.18,60.83 140.97,59.94 142.88,76.07 138.94,75.18 139.7,82.04 136.78,88.27 127.13,91.95 130.56,97.92 146.81,93.34 141.73,39.62 141.73,26.92 127.64,26.92 119,32.13 107.82,37.08 101.22,37.72 93.47,44.83 120.65,18.29 151.13,13.59 151.51,3.94 144.78,1.65 130.68,1.52 114.3,1.52 126.87,9.78 137.92,5.71 142.37,4.19 137.41,11.05 137.67,16.26 141.35,11.68 141.22,16.89 114.3,6.22 118.75,10.67 122.43,10.54 103.89,90.04 101.35,96.9 133.86,65.41 127.38,37.97 121.16,38.61 117.47,40.64 137.92,40.64 137.29,31.75 137.41,24.64 120.65,24.77 106.3,43.31 105.79,45.34 112.01,43.43 117.73,44.96 132.33,48.13 137.79,53.85 133.48,55.37 145.41,33.78 145.29,25.15 129.67,19.94 145.92,59.44 146.18,65.41 148.97,74.8 158.24,81.92 157.73,59.82 158.12,37.59 108.71,1.52 109.35,6.6 109.09,8.13 125.35,51.18 116.08,14.35 113.54,21.84 105.79,29.59 91.95,36.58 127.51,55.88 126.75,53.85 129.67,53.21 135.25,46.1 137.29,48.01 135.76,56.39 126.87,46.86 125.35,49.02 122.05,43.81 127.25,44.83 122.05,40.13 129.16,66.29 123.95,74.3 133.48,76.96 132.97,73.28 115.95,73.41 115.95,67.31 117.09,82.93 106.43,80.01
  pour Top (isolate 0.254): 160.02,0 160.02,99.95 90.3,99.95 90.3,59.18 124.71,59.18 124.71,47.12 90.3,47.12 90.3,35.43 98.68,35.43 115.19,18.92 115.19,9.91 114.3,9.02 106.93,9.02 106.93,0
  pour Bottom (isolate 0.254): 160.02,0 160.02,99.95 90.3,99.95 90.3,59.31 91.06,59.31 91.06,59.18 124.84,59.18 124.84,47.12 90.42,47.12 90.42,35.43 98.68,35.43 115.19,18.92 115.19,9.91 114.3,9.02 106.81,9.02 106.81,0
DVCC  (via drill 0.35)
  Top 0.152: 121.28,45.3 121.14,45.45 121.14,45.19 C33.1 | C+3.+ | 104.27,41.76 R1.1 | 139.49,19.65 139.57,19.56
  Top 0.356: U$1.24 121.28,45.3
  Top 0.508: JP7.8 120.26,3.94 C+3.+ 117.22,6.98 117.22,20.07 104.27,33.02 104.27,41.76 | R116.1 139.45,8.98 139.57,9.11 | R115.1 139.57,14.31 | 139.57,14.31 R111.1 | C+3.+ 139.57,3.56 139.57,9.11 | 139.57,14.31 139.57,19.56 v139.57,20.57 | 139.57,14.31 139.57,9.11 | R121.1 R120.1 111.2,70.45 R101.1 | 132.08,92.46 128.02,88.39 111.12,88.39 109.6,86.87 109.6,81.15 110.96,79.8 R123.1 R122.1 R121.1 | 132.08,92.46 R117.1 | JP14.2 130.05,94.49 132.08,92.46 | R1.1 117.26,41.82 118.39,42.95 C35.1 121.06,44.56 C33.1 | 139.57,9.11 143.13,9.11 R110.1 | R114.1 139.49,19.65 R112.1 | v139.57,23.5 139.57,33.4 144.02,37.85 v144.02,41.53 | v144.02,57.4 144.02,64.9 v143.76,65.15 | v139.06,69.85 138.47,70.45 R121.1
  Bottom 0.508: v139.57,20.57 v139.57,23.5 | v144.02,41.53 v144.02,57.4 | v143.76,65.15 v139.06,69.85
DVSYS
  Top 0.152: U$1.23 133.18,45.8 134.62,47.24 134.62,52.7 138.72,56.8 U$1.75
  Top 0.178: U$1.23 122.6,45.8 122.05,46.35 117.26,46.35 C34.1 C36.1
EXT
  Top 0.406: JTAG.4 102.62,96.52 103.5,97.41 120.27,97.41 121.28,96.39 121.28,93.09 122.43,91.95 JP14.3
H1_OUT
  Top 0.152: JP9.6 JP9.4 JP9.2 53.34,62.61 | H12.6 46.2,56.52 48.1,54.61 TP2.TP 53.34,58.42 53.34,62.61 | 53.34,62.61 47.24,62.61 45.21,60.58 36.73,60.58 35.56,59.41 C_H12.0.1
H2_OUT
  Top 0.152: C_H22.0.1 37.15,36.83 49.28,36.83 50.51,35.6 50.51,31.46 TP9.TP | H22.6 47.18,31.11 47.81,30.48 TP9.TP | TP9.TP 54.36,35.31 JP3.4 | JP3.4 JP3.2 | JP3.4 JP3.6
H11_OUT  (via drill 0.35)
  Top 0.152: C_H11.0.1 v38.03,70.8 | 49.02,66.04 48.61,66.04 46.71,67.94 H11.6 | 49.02,66.04 TP15.TP | 49.02,66.04 44.45,61.47 31.62,61.47 30.48,60.33 C_H12.1.1
  Bottom 0.152: TP15.TP 47.37,68.2 42.5,68.2 39.9,70.8 v38.03,70.8
H21_OUT  (via drill 0.35)
  Top 0.152: C_H21.0.1 37.94,47.94 40.8,50.81 51.45,50.81 v51.56,50.92 | v51.56,48.13 51.56,45.21 TP17.TP | TP17.TP 48.49,43.18 46.58,45.09 H21.6 | TP17.TP 49.53,42.15 45.48,38.1 31.75,38.1 30.48,36.83 C_H22.1.1
  Bottom 0.152: v51.56,50.92 v51.56,48.13
INA1_OUT
  Top 0.152: JP8.2 JP8.4 JP8.6 | JP8.6 JP8.2 | JP8.2 22.86,60.96 TP1.TP | JP8.6 22.86,72.39 21.59,73.66 18.48,73.66 RZ_1.2 16.2,73.41 INA_1.6
INA2_OUT  (via drill 0.35)
  Top 0.152: INA_2.6 14.43,17.91 RZ_2.2 18.11,18.8 18.11,22.43 19.84,24.16 19.84,34.86 19.23,35.46 19.23,35.49 v19.3,35.56 | v19.19,39.01 19.21,38.99 JP2.2 JP2.4 JP2.6 19.81,45.85 TP8.TP
  Bottom 0.152: v19.3,35.56 19.3,38.89 v19.19,39.01
INT
  Top 0.406: JTAG.2 100.08,98.04 100.58,98.55 121.41,98.55 JP14.1
LED1
  Top 0.152: U$1.37 131.07,40.89 132.84,39.12 LED1.C
LED2
  Top 0.152: U$1.36 130.57,40.62 132.33,38.86 132.33,26.16 127.76,21.59 127.76,15.49 128.49,14.77 LED2.C
LED3
  Top 0.152: U$1.34 129.57,40.86 131.83,38.61 131.83,26.42 127.25,21.84 127.25,15.02 LED3.C
LED4
  Top 0.152: U$1.42 133.57,40.67 134.37,39.88 134.37,22.86 134.87,22.35 147.32,22.35 148.34,21.34 148.34,11.46 LED4.C
LED5
  Top 0.152: U$1.41 133.1,42.78 133.1,40.39 133.86,39.62 133.86,22.35 134.37,21.84 147.07,21.84 147.83,21.08 147.83,16.29 LED5.C
LED6
  Top 0.152: U$1.40 132.57,40.15 133.35,39.37 133.35,22.1 134.11,21.34 145.07,21.34 LED6.C
LS+
  Top 0.152: R_LS1.1 3.94,18.03 | INA_2.3 8.55,17.78 4.13,17.78 R_LS1.1 | X_LS.5 7.12,46.91 1.18,40.96 1.18,35.36 2.16,34.38 2.16,18.1 2.29,17.97 R_LS1.1
LS-
  Top 0.152: INA_2.2 4.51,19.3 R_LS1.2 3.81,20 3.81,33.02 3.86,33.02 7.75,36.91 X_LS.2
LS_TO_ADC2  (via drill 0.35)
  Top 0.15: JP16.2 81.47,36.13 80.64,35.31 59.94,35.31
  Top 0.152: JP4.3 54.5,12.45 53.73,13.22 53.73,23.88 56.85,27.01 56.85,28.55 57.26,28.96 v57.4,28.96 | v59.94,28.96 59.94,35.31 JP3.5 | JP6.1 84.58,26.92 TP6.TP 83.06,34.54 81.47,36.13
  Bottom 0.152: v57.4,28.96 v59.94,28.96
MCLK  (via drill 0.35)
  Top 0.152: U$1.33 129.07,44.24 129.79,44.96 v136.53,44.96 | CLOCK.4 153.42,8.51 153.42,18.03 147.7,23.75 147.7,41.53 146.3,42.93 v139.32,42.93
  Bottom 0.152: v136.53,44.96 138.56,42.93 v139.32,42.93
N1_OUT
  Top 0.15: 74.12,89.04 74.12,90.63 74.11,90.65 74.11,94.17
  Top 0.152: C_N11.0.1 62.7,93.66 63.83,94.79 73.49,94.79 74.11,94.17 | 74.12,90.63 69.96,90.63 N11.6 | 74.12,89.04 R_N1.5.2 74.61,87.31 JP11.2 | JP11.2 TP4.TP | JP11.2 JP11.4 JP11.6
N2_OUT
  Top 0.152: TP11.TP 78.67,18.48 R_N2.5.2 75.18,21.69 73.63,23.24 N21.6 | N21.6 78.36,23.24 JP6.2 JP6.4 JP6.6 | C_N21.0.1 66.61,27.69 69.34,27.69 69.98,27.05 69.98,24 70.74,23.24 N21.6
N$1
  Top 0.152: R_INA2_VAR.2 16.82,30.11 R_INA2_MIN.1
N$3
  Top 0.152: R_H11.1.1 31.12,68.9 C_H11.1.2 C_H11.2.1
N$4
  Top 0.152: C_H11.2.2 31.12,63.82 R_H11.2.2 35.31,65.72 37.53,67.94 H11.3
N$5
  Top 0.152: RZ_1.1 19.11,70.07 D1.1
N$6
  Top 0.152: D1.3 D2.3
N$7
  Top 0.152: R_H12.1.1 32.38,59.37 C_H12.1.2 C_H12.2.1
N$8
  Top 0.152: C_H12.2.2 31.12,52.39 R_H12.2.2 35.56,54.29 37.78,56.52 H12.3
N$9
  Top 0.152: C_T11.1.1 26.03,94.93 R_T11.1.2 R_T11.2.1
N$10
  Top 0.152: R_H11.1.2 C_H11.0.2 40.39,68.9 H11.2
N$11
  Top 0.152: R_T11.2.2 24.77,87.95 C_T11.2.2 28.89,92.08 T11.3
N$12
  Top 0.152: C_T12.1.1 24.77,81.6 R_T12.1.2 R_T12.2.1
N$13
  Top 0.152: R_H12.1.2 C_H12.0.2 40.39,57.47 H12.2
N$14
  Top 0.152: R_T12.2.2 26.03,78.42 C_T12.2.2 29.08,78.42 31.31,80.64 T12.3
N$15
  Top 0.152: C_T12.1.2 C_T12.0.2 34.04,81.6 T12.2
N$16
  Top 0.152: JP5.4 7.94,81.98 R_INA1_CONST.1
N$17  (via drill 0.35)
  Top 0.152: R_N1.3PARALLEL.2 56.83,81.6 55.88,82.55 55.88,87.63 56.83,88.58 R_N1.2.2 C_N1.1.2 R_N1.1.2 R_N1.3.2 59.69,90.17 v60.96,90.17 | v63.5,90.17 64.14,90.81 N11.3
  Bottom 0.152: v60.96,90.17 v63.5,90.17
N$18  (via drill 0.35)
  Top 0.152: R_N1.3PARALLEL.1 59.05,81.6 R_N1.3SERIELL.1 61,82.91 61,84.62 61.59,85.22 v62.23,85.22 C_N1.2.1 | v64.05,86.36 65.72,86.36 C_N12.0.2 68.51,83.57 v68.51,81.28 | v71.12,80.01 70.42,80.01 N12.6
  Bottom 0.152: v62.23,85.22 62.91,85.22 v64.05,86.36 | v68.51,81.28 69.78,80.01 v71.12,80.01
N$19
  Top 0.152: N11.2 64.52,91.76 C_N11.0.2 C_N1.2.2 62.55,88.58 63.5,87.63 63.5,84.77 R_N1.4.1 61.05,82.32 61.05,80.86 60.2,80.01 58.42,80.01 57.15,78.74 R_N1.4PARALLEL.1
N$20
  Top 0.152: R_N1.4PARALLEL.2 R_N1.4SERIELL.2 60.96,77.79 60.96,78.87 62.73,80.64 N12.2 63.5,80.64 63.5,83.5 C_N12.0.1
N$21
  Top 0.152: C_T11.1.2 C_T11.0.2 34.04,93.03 T11.2
N$22  (via drill 0.35)
  Top 0.152: R_N1.6.2 72.39,83.82 | 72.39,83.82 R_N1.5.1 | v71.12,83.82 72.39,83.82 | N12.3 65.89,79.38 66.33,79.82 v66.33,80.23
  Bottom 0.152: v66.33,80.23 69.37,83.27 70.08,83.27 70.63,83.82 v71.12,83.82
N$23
  Top 0.152: LED1.A 132.9,17.95 R114.2
N$24
  Top 0.152: R_H21.1.1 31.12,46.04 C_H21.1.2 C_H21.2.1
N$25
  Top 0.152: C_H21.2.2 31.12,40.96 R_H21.2.2 36.32,42.86 38.55,45.09 H21.3
N$26
  Top 0.152: R_H22.1.1 31.12,33.34 C_H22.1.2 C_H22.2.1
N$27
  Top 0.152: C_H22.2.2 31.12,28.26 R_H22.2.2 33.15,30.16 34.74,31.75 39.05,31.75 39.69,31.11 H22.3
N$28
  Top 0.152: C_T21.1.1 31.11,22.54 R_T21.1.2 R_T21.2.1
N$29
  Top 0.152: R_T21.2.2 31.11,17.46 C_T21.2.2 33.98,19.68 T21.3
N$30
  Top 0.152: C_T22.1.1 29.85,7.94 R_T22.1.2 R_T22.2.1
N$31
  Top 0.152: R_T22.2.2 29.85,2.86 C_T22.2.2 33.98,6.99 T22.3
N$32  (via drill 0.35)
  Top 0.152: R_N2.1.2 C_N2.1.2 R_N2.2.2 59.94,20.84 58.84,19.73 58.84,10.11 59.94,9.01 R_N2.3PARALLEL.2 | R_N2.1.2 R_N2.3.2 | R_N2.1.2 63.75,22.93 v63.75,22.61 | v66.29,22.61 66.93,23.24 N21.3
  Bottom 0.152: v63.75,22.61 v66.29,22.61
N$33  (via drill 0.35)
  Top 0.152: R_N2.3PARALLEL.1 R_N2.3SERIELL.1 61.25,15.35 61.25,16.81 61.77,17.32 63.23,17.32 C_N2.2.1 66.65,17.49 68.75,17.49 69.78,16.46 C_N22.0.2 69.78,14.7 71.02,13.46 v71.02,12.26 | v73.91,11.18 73.91,10.86 73.59,10.54 N22.6
  Bottom 0.152: v71.02,12.26 71.27,12.26 72.36,11.18 v73.91,11.18
N$34  (via drill 0.35)
  Top 0.152: N21.2 67.31,24.2 C_N21.0.2 C_N2.2.2 65.79,21.02 66.29,20.51 v66.29,18.8 | R_N2.4PARALLEL.1 R_N2.4.1 v65.02,17.53
  Bottom 0.152: v66.29,18.8 v65.02,17.53
N$35
  Top 0.152: R_N2.4SERIAL.2 R_N2.4PARALLEL.2 63.18,14.04 64.05,14.91 66.16,14.91 | C_N22.0.1 66.54,14.91 66.16,14.91 | 66.16,14.91 66.16,12.39 66.74,11.81 N22.2
N$36  (via drill 0.35)
  Top 0.152: R_N2.6.2 75.18,14.99 | 75.18,14.99 R_N2.5.1 | N22.3 68.27,10.54 69.34,11.61 v69.34,11.68 | v73.91,14.99 75.18,14.99
  Bottom 0.152: v69.34,11.68 72.64,14.99 v73.91,14.99
N$37
  Top 0.152: JP1.4 9.34,29.15 R_INA2_CONST.1
N$38
  Top 0.152: R115.2 132.9,12.61 LED2.A
N$39
  Top 0.152: JP1.2 R_INA2_VAR.1
N$40
  Top 0.152: JP5.2 R_INA1_VAR.1
N$41  (via drill 0.35)
  Top 0.152: JP2.5 26.42,44.07 | C_H21.1.1 30.16,48.26 26.42,48.26 26.42,44.07 | JP4.5 54.86,16.26 55.83,17.22 55.83,24.64 57.78,26.59 v57.78,27.69 | v61.21,27.69 61.85,27.69 64.76,30.6 80.25,30.6 81.53,29.32 JP6.5 | v55.88,27.69 53.47,25.27 45.64,25.27 45.22,24.85 34.37,24.85 33.66,24.13 v30.48,24.13 | v28.04,24.11 27.98,24.11 27.98,27.77 26.42,29.34 26.42,44.07
  Bottom 0.152: v61.21,27.69 v57.78,27.69 v55.88,27.69 | v30.48,24.13 28.07,24.13 v28.04,24.11
N$42  (via drill 0.35)
  Top 0.152: JP8.5 v27.94,71.12 30.16,71.12 C_H11.1.1 | v27.94,73.66 37.47,73.66 40.01,76.2 44.32,76.2 45.72,77.6 45.72,85.34 48.13,87.76 48.13,92.58 JP10.5 51.82,93.98 53.72,95.89 76.83,95.89 JP11.5
  Bottom 0.152: v27.94,71.12 v27.94,73.66
N$43  (via drill 0.35)
  Top 0.15: 29.21,24.51 31.37,26.67 43.18,26.67 43.81,27.3 51.94,27.3
  Top 0.152: 29.21,24.51 R_T21.1.1 27.3,22.54 22.86,26.98 22.86,40.26 JP2.3 | v58.67,34.04 JP3.3 56.33,34.23 56.33,31.69 54.74,30.1 54.36,29.72 51.94,27.3 | JP6.3 83.18,28.06 83.18,31.73 80.88,34.04 v60.71,34.04
  Bottom 0.152: v58.67,34.04 v60.71,34.04
N$44  (via drill 0.35)
  Top 0.15: 33.91,25.78 44.32,25.78 44.96,26.42 52.96,26.42 56.77,30.23
  Top 0.152: 58.73,26.1 57.4,24.77 57.4,12.45 JP4.1 57.78,6.99 v67.18,6.99 | 58.73,26.1 58.61,26.1 58.61,30.23 | 58.73,26.1 C_N2.1.1 R_N2.1.1 | R_N2.6.1 75.18,9.27 v73.03,7.11 | JP3.1 58.61,31.56 58.61,30.23 | JP2.1 24.13,28.07 v26.8,25.4 | v31.75,25.4 33.53,25.4 33.91,25.78 | 56.77,30.23 58.61,30.23
  Bottom 0.152: v26.8,25.4 v31.75,25.4 | v73.03,7.11 67.31,7.11 v67.18,6.99
N$45  (via drill 0.35)
  Top 0.152: R_T11.1.1 22.54,94.93 21.97,94.36 21.97,75.44 24.96,72.45 | 24.96,72.45 25.02,72.39 37.59,72.39 40.31,75.11 43.02,75.11 45.87,72.26 53.95,72.26 54.73,71.49 54.73,69.73 JP9.3 55.91,68.61 65.48,68.61 80.01,83.14 v80.01,87.63 | v80.01,90.17 JP11.3 | JP8.3 24.13,69.85 24.13,71.63 24.96,72.45
  Bottom 0.152: v80.01,87.63 v80.01,90.17
N$46
  Top 0.152: R116.2 132.9,7.28 LED3.A
N$47
  Top 0.152: LED7.A R117.2
N$48
  Top 0.152: R110.2 146.25,7.28 LED4.A
N$49  (via drill 0.35)
  Top 0.15: 54.31,93.66 C_N1.1.1
  Top 0.152: JP10.1 54.29,93.66 54.31,93.66 v54.31,81.71 | C_N1.1.1 R_N1.1.1 | v72.39,73.79 72.39,72.68 65.73,66.02 55.9,66.02 JP9.1 v54.61,64.77 | JP8.1 28.91,62.53 43.48,62.53 v45.72,64.77 | v72.39,78.74 R_N1.6.1
  Bottom 0.152: v72.39,73.79 v72.39,78.74 56.88,78.74 55.84,79.78 55.84,80.18 v54.31,81.71 | v54.61,64.77 50.11,64.77 50.07,64.73 48.99,64.73 48.95,64.77 v45.72,64.77
N$50
  Top 0.152: RZ_2.1 18.82,17.62 D4.1
N$51
  Top 0.152: D4.3 D3.3
N$52
  Top 0.152: R_H21.1.2 C_H21.0.2 40.39,46.04 H21.2
N$53
  Top 0.152: R111.2 146.25,12.61 LED5.A
N$54
  Top 0.152: R_INA1_MIN.1 16.69,80.89 R_INA1_VAR.2
N$55
  Top 0.152: R112.2 146.25,17.95 LED6.A
N$58
  Top 0.152: R_H22.1.2 C_H22.0.2 39.2,33.34 40.16,32.38 H22.2
N$59
  Top 0.152: C_T22.1.2 C_T22.0.2 39.12,7.94 T22.2
N$60
  Top 0.152: C_T21.1.2 C_T21.0.2 39.12,20.64 T21.2
N$61
  Top 0.152: X_LS.1 7.62,41.91 8.89,43.18 11.43,43.18 12.7,41.91 JP12.2
N$62
  Top 0.152: JP13.2 11.54,57.53 10.56,58.51 9.76,58.51 8.78,57.53 X_RS.1
N$70
  Top 0.152: U$1.51 146.97,44.8 149.35,42.42 149.35,24.51 156.34,17.53 P1.1
N$71
  Top 0.152: U$1.52 147.23,45.3 149.99,42.55 149.99,26.42 156.34,20.07 P1.2
N$72
  Top 0.152: U$1.53 147.49,45.8 150.62,42.67 150.62,28.32 156.34,22.61 P1.3
N$73
  Top 0.152: U$1.54 147.76,46.3 151.26,42.8 151.26,30.23 156.34,25.15 P1.4
N$74
  Top 0.152: U$1.55 148.02,46.8 151.76,43.05 151.76,32.26 156.34,27.69 P1.5
N$75
  Top 0.152: U$1.56 148.28,47.3 152.27,43.31 152.27,34.29 156.34,30.23 P1.6
N$76
  Top 0.152: U$1.57 148.54,47.8 152.78,43.56 152.78,36.32 156.34,32.77 P1.7
N$77
  Top 0.152: U$1.58 148.8,48.3 153.29,43.81 153.29,38.35 156.34,35.31 P1.8
N$83
  Top 0.152: U$1.67 148.81,52.8 151.38,55.37 151.38,57.28 P5.1
N$84
  Top 0.152: U$1.68 148.55,53.3 150.88,55.63 150.88,59.31 P5.2
N$85
  Top 0.152: U$1.69 139.62,53.85 148.34,53.85 150.37,55.88 150.37,61.34 P5.3
N$86
  Top 0.152: U$1.70 148.03,54.3 149.86,56.13 149.86,63.37 P5.4
N$87
  Top 0.152: U$1.71 147.89,54.8 149.35,56.26 149.35,64.89 156.21,71.75 P5.5
N$88
  Top 0.152: U$1.72 139.64,55.37 147.7,55.37 148.84,56.52 148.84,67.44 P5.6
N$89
  Top 0.152: U$1.73 147.37,55.8 148.34,56.77 148.34,69.47 P5.7
N$90
  Top 0.152: U$1.74 147.23,56.3 147.83,56.9 147.83,71.5 P5.8
N$91
  Top 0.152: P4.5 155.45,50.8 U$1.63
N$92
  Top 0.152: U$1.78 136.57,60.5 146.69,70.61 146.69,77.22 P6.2
N$93
  Top 0.152: U$1.77 137.07,60.24 147.19,70.36 147.19,75.18 P6.1
N$94
  Top 0.152: R_N2.4SERIAL.1 63.79,10.27 63.79,11.85 65.02,13.08 R_N2.4.2
N$95
  Top 0.152: R_N2.3.1 62.36,19.12 59.94,16.7 R_N2.3SERIELL.2
N$96
  Top 0.152: R_N1.3.1 R_N1.3SERIELL.2
N$97
  Top 0.152: R_N1.4SERIELL.1 62.23,80.96 R_N1.4.2
P4.0
  Top 0.152: U$1.59 149.13,48.8 153.8,44.13 153.8,41.27 155.19,39.88 P4.1
P4.3
  Top 0.152: P4.4 152.65,47.5 149.85,50.3 U$1.62
P4.5
  Top 0.152: P4.6 154.93,51.3 U$1.64
P4.6
  Top 0.152: U$1.65 152.26,51.8 155.57,55.12 P4.7
P4.7
  Top 0.152: U$1.66 139.6,52.32 150.88,52.32 P4.8
P6.2
  Top 0.152: U$1.79 136.07,60.76 146.18,70.87 146.18,79.25 P6.3
P6.3
  Top 0.152: U$1.80 135.57,61.02 145.67,71.12 145.67,81.28 P6.4
P6.4
  Top 0.152: U$1.81 135.07,61.28 145.16,71.37 145.16,83.31 P6.5
P6.5
  Top 0.152: U$1.82 134.57,61.55 144.65,71.63 144.65,85.34 P6.6
REF
  Top 0.152: INA_1.5 14.18,61.77 17.78,58.17 JP13.1 JP12.1 17.78,38.62 21.65,34.75 21.65,15.24 19.83,15.24 19.45,14.86 16.21,14.86 INA_2.5
RESET  (via drill 0.35)  (1 unrouted)
  Top 0.152: v104.27,75.18 104.31,75.14 C110.2 R101.2 108.2,87.5 112.78,92.08 JTAG.11 | U$1.100 125.57,60.61 124.71,61.47 108.97,61.47 100.71,69.72 v100.71,75.18 99.76,76.14 99.65,76.25 98.34,77.56
  Bottom 0.152: v100.71,75.18 v104.27,75.18
RG1+
  Top 0.152: JP5.1 JP5.3 6.35,77.47 7.87,75.95 INA_1.1
RG1-
  Top 0.152: R_INA1_CONST.2 R_INA1_MIN.2 14.18,77.96 INA_1.8
RG2+
  Top 0.152: INA_2.1 7.75,21.63 JP1.3 JP1.1
RG2-
  Top 0.152: R_INA2_CONST.2 R_INA2_MIN.2 14.31,25.67 INA_2.8
RS+
  Top 0.152: X_RS.5 6.65,66.04 5.08,66.04 3.81,67.31 3.81,72.77 | 3.81,72.77 R_RS.1 | 3.81,72.77 4.45,73.41 INA_1.3
RS-
  Top 0.152: X_RS.2 7.12,52.53 3.81,55.84 3.81,63.75 2.03,65.53 2.03,72.96 R_RS.2 3.87,74.68 INA_1.2
RS_TO_ADC1
  Top 0.152: JP10.3 48.56,90.47 48.56,79.31 48.58,79.31 55.88,72.01 JP9.5 55.88,71.2 66.5,71.2 78.74,83.44 JP11.1 80.26,88.9 82.93,86.23 TP5.TP 81.92,83.82 81.92,59.31 JP15.2
RTCCLK  (via drill 0.35)
  Top 0.152: U$1.94 128.57,57.23 133.1,52.7 133.1,50.42 v133.35,50.16 | CLOCK.2 154.43,12.57 154.43,18.41 148.84,24 148.84,42.16 146.81,44.2 139.06,44.2 v137.54,45.72
  Bottom 0.152: v133.35,50.16 137.54,45.97 v137.54,45.72
SD_IN_1P
  Top 0.152: JP15.1 86.2,56.8 U$1.1
SD_IN_2P
  Top 0.152: JP16.1 87.38,54.8 U$1.5
SMCLK  (via drill 0.35)
  Top 0.152: U$1.32 128.57,41.83 v128.52,41.78 | v135.51,39.75 135.51,24 136.65,22.86 147.57,22.86 152.78,17.65 152.78,6.6 CLOCK.5
  Bottom 0.152: v135.51,39.75 135.51,41.4 135.13,41.78 v128.52,41.78
T1_OUT
  Top 0.15: 44.2,85.47 44.07,85.35 44.07,85.01
  Top 0.152: JP10.6 JP10.4 JP10.2 46.99,88.27 44.2,85.47 | C_T12.0.1 29.3,83.5 31.19,85.39 44.07,85.39 44.07,85.01 44.07,79.63 TP3.TP 41.78,80.14 39.81,80.14 T12.6
T2_OUT
  Top 0.152: JP4.6 JP4.4 JP4.2 51.05,8.64 51.05,7.49 TP10.TP | C_T22.0.1 37.02,12.57 50.04,12.57 TP10.TP | TP10.TP 49.28,5.71 46.16,5.71 44.89,6.99 T22.6
T11_OUT  (via drill 0.3)
  Top 0.15: C_T11.0.1 30.29,96.01 v38.61,96.01
  Top 0.152: T11.6 40.01,92.08 41.91,90.17 TP16.TP 41.93,90.17 39.73,87.97 33.4,87.97 33.4,86.36 24.13,86.36 R_T12.1.1
  Bottom 0.15: v38.61,96.01 38.86,96.01 43.18,91.69 TP16.TP
T21_OUT  (via drill 0.3)
  Top 0.15: C_T21.0.1 35.62,22.54 35.69,22.61 v35.81,22.61
  Top 0.152: T21.6 44.51,19.56 47.81,19.56 48.26,19.11 TP18.TP 43.18,13.97 30.48,13.97 29.21,12.7 R_T22.1.1
  Bottom 0.15: v35.81,22.61 38.1,22.61 41.66,19.05 TP18.TP
TCK  (via drill 0.35)
  Top 0.152: U$1.99 126.07,61 124.97,62.1 v109.98,62.1 | v109.98,64.9 109.73,64.9 103.63,70.99 103.63,86.23 107.7,90.3 JTAG.7
  Bottom 0.152: v109.98,62.1 v109.98,64.9
TDI
  Top 0.152: U$1.97 127.07,61.65 125.48,63.25 108.97,63.25 102.06,70.15 102.06,89.2 98.3,92.96 98.3,93.47 98.81,93.98 101.6,93.98 JTAG.3
TDO
  Top 0.152: U$1.96 127.57,61.91 125.73,63.75 109.22,63.75 102.62,70.36 102.62,90.42 JTAG.1
TEST/SBWTCK
  Top 0.152: U$1.95 128.07,62.17 125.98,64.26 109.47,64.26 103.12,70.61 103.12,86.36 106.17,89.41 106.17,94.11 107.57,95.5 JTAG.8
TMS
  Top 0.152: U$1.98 126.57,61.26 125.09,62.74 108.71,62.74 101.47,69.98 101.47,88.01 97.54,91.95 97.54,93.98 98.04,94.49 103.63,94.49 JTAG.5
UART_RX  (via drill 0.35)
  Top 0.152: P4.2 149.35,49.28 139.6,49.28 U$1.60 137.9,49.3 v137.54,49.66
  Bottom 0.152: v137.54,49.66 137.58,49.7 137.58,52.3 137.08,52.81 137.08,81.49 128.27,90.3 119.76,90.3 117.22,92.84 117.22,94.49 116.2,95.5 JTAG.14
UART_TX  (via drill 0.35)
  Top 0.152: P4.3 154.43,44.96 149.59,49.8 U$1.61 138.54,49.8 137.03,51.31 v136.14,51.31
  Bottom 0.152: v136.14,51.31 136.14,51.56 134.75,52.96 134.75,81.03 127,88.77 116.59,88.77 114.3,91.06 114.3,93.98 JTAG.12
VASYS1/2
  Top 0.152: U$1.9 123.7,52.8 | 123.7,52.8 125.22,52.83 126.36,51.69 126.36,48.39 | 123.7,52.8 122.2,52.8 121.41,53.59 114.53,53.59 C22.1 C23.1 109.09,51.97 C28.1 105.22,52.09 C32.1
  Top 0.178: 126.36,48.39 125.28,47.3 U$1.20
VCORE
  Top 0.305: U$1.26 125.57,42.55 125.32,42.29 C38.1
VREF
  Top 0.178: U$1.11 119.99,51.8 C30.1
XIN
  Top 0.152: U$1.27 126.07,41.87 123.59,39.39 XT1.P2 123.59,37.19 C100.1
XOUT
  Top 0.152: U$1.28 126.57,41.48 126.09,41 XT1.P1 126.09,37.19 C101.1

## Text on the board
tPlace: Notch | Tiefpass | ACT LED | BIOFEEDBACK | Gröber, Hartl, Kirchner, Laber | C+ | HP | HP | TM | C+ | powered by MSP430 | ADC | TP | C- | ADC | C- | N | C+ | TP | Notch | BUTTONS | 2ADC | P6 OUT | BTN4 | BTN3 | C+ | C+ | C- | C- | RESET | ADC | HP | C- | C+ | TP | DGND | TP | C- | BTN1 | BTN2 | N | N | INA | HP | P5 OUT | JP 2ADC RS | MSP430F6779A | C+ | C- | Rechte Schulter | Hochpass | Hochpass | JP 2ADC LS | Linke Schulter | C+ | HP | TP | C- | P4 OUT | N | H2ADC | INA | C+ | 2ADC | TP | Notch | N | HP | C- | DGND | HP | C+ | TP | Tiefpass | C+ | C+ | ADC | Notch | #1 | #6 | C- | C+ | P3 OUT | C- | C- | #2 | #5 | CLOCK | HP | DGND | T2ADC | #3 | #4 | RTC | N | C- | A | TP | C+ | -9V | AGND | +9V | -1.5V | +1.5V | AGND | DGND | 3V | M | C- | LEDs | SM